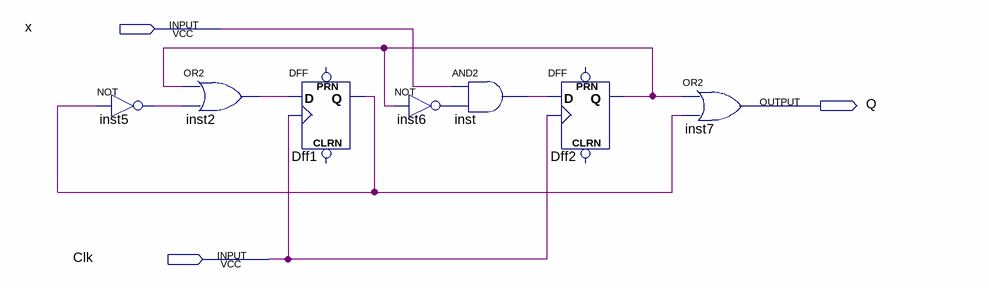
[diagram p0: schematic sheet]
// Quartus schematic exercise42.bdf as structural Verilog: 7 symbols, 3 pins
module exercise42 (
  input  x,
  input  Clk,
  output Q
);

  wire Dff1_q, Dff2_q, inst2_out, inst5_out, inst6_out, inst_out;

  not inst5 (inst5_out, Dff1_q);
  or inst2 (inst2_out, Dff2_q, inst5_out);
  DFF Dff1 (.CLK(Clk), .D(inst2_out), .Q(Dff1_q));  // open: CLRN, PRN
  and inst (inst_out, x, inst6_out);
  not inst6 (inst6_out, Dff2_q);
  DFF Dff2 (.CLK(Clk), .D(inst_out), .Q(Dff2_q));  // open: CLRN, PRN
  or inst7 (Q, Dff2_q, Dff1_q);
endmodule
